# Altium schematic sheet Driver.SchDoc: MotorDriver
size Letter; ApprovedBy: APPROUVÉ PAR; Author: Javier Bolduc; Organization: Cegep Limoilou; Address1: 1300, 8e Avenue; Address2: Québec, QC; Address3: Canada; Address4: G1J 5L5; SheetNumber: 2; SheetTotal: 2
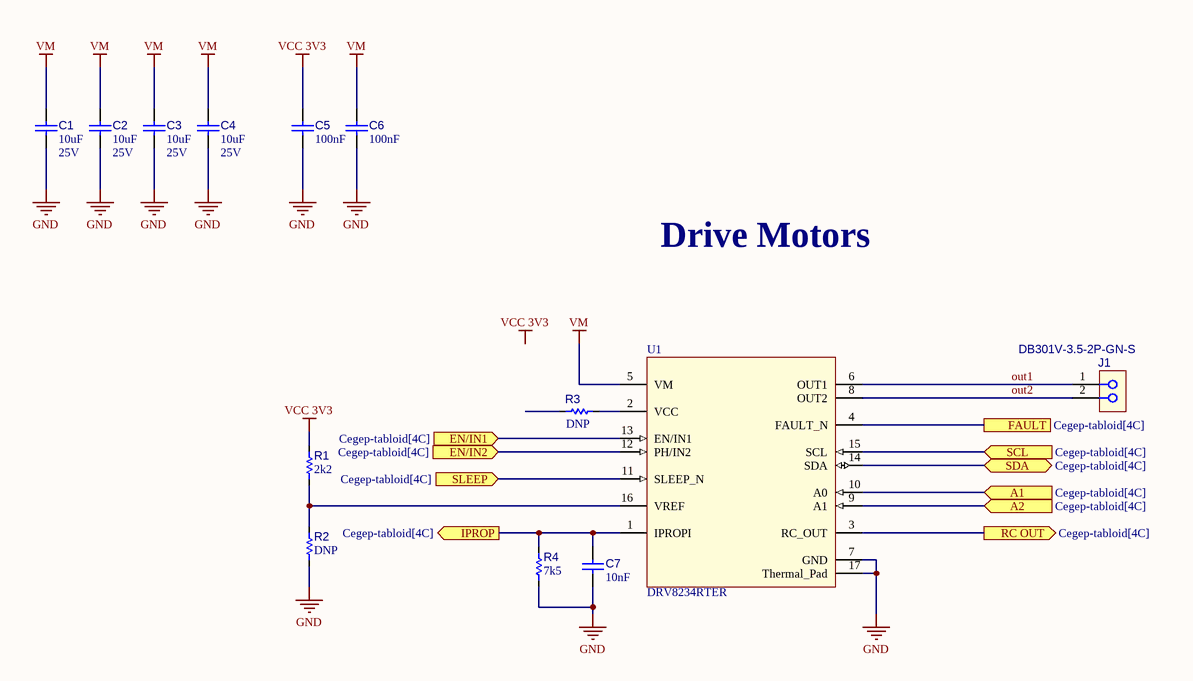
[diagram p0: Driver.SchDoc]

## Parts
C1  value 10uF  Rated Voltage: 25V  [C_2012[0805]]  (hidden comment: CAP CER 10uF 25V X5R 0805)
C2  value 10uF  Rated Voltage: 25V  [C_2012[0805]]  (hidden comment: CAP CER 10uF 25V X5R 0805)
C3  value 10uF  Rated Voltage: 25V  [C_2012[0805]]  (hidden comment: CAP CER 10uF 25V X5R 0805)
C4  value 10uF  Rated Voltage: 25V  [C_2012[0805]]  (hidden comment: CAP CER 10uF 25V X5R 0805)
C5  value 100nF  [C_1005[0402]]  (hidden comment: CAP CER 100nF 50V 0402)
C6  value 100nF  [C_1005[0402]]  (hidden comment: CAP CER 100nF 50V 0402)
C7  value 10nF  [C_1005[0402]]  (hidden comment: CAP CER 10nF 50V X7R 0402)
J1  DB301V-3.5-2P-GN-S  [CONN_TERM_BLOCK_2POS_3mm5]
R1  value 2k2  [R_1005[0402]]  (hidden comment: Res 2k2 1% 0402)
R2  value DNP  [R_1005[0402]]  (hidden comment: Res 2k2 1% 0402)  (no BOM)
R3  value DNP  [R_1005[0402]]  (hidden comment: Res 2k2 1% 0402)  (no BOM)
R4  value 7k5  [R_1005[0402]]  (hidden comment: Res 7k5 1% 0402)
U1  DRV8234RTER  [U_WQFN50P300X300-16]

## Ports
A1 (in, see Cegep-tabloid[4C]), A2 (in, see Cegep-tabloid[4C]), EN/IN1 (in, see Cegep-tabloid[4C]), EN/IN2 (in, see Cegep-tabloid[4C]), FAULT (see Cegep-tabloid[4C]), IPROP (out, see Cegep-tabloid[4C]), RC OUT (out, see Cegep-tabloid[4C]), SCL (in, see Cegep-tabloid[4C]), SDA (bidir, see Cegep-tabloid[4C]), SLEEP (in, see Cegep-tabloid[4C])

## Nets
GND: C1.2 C2.2 C3.2 C4.2 C5.2 C6.2 C7.1 R2.2 R4.2 U1.7(GND) U1.17(Thermal_Pad)
VCC 3V3: C5.1 R1.1
VM: C1.1 C2.1 C3.1 C4.1 C6.1 U1.5(VM)
A1: U1.10(A0) ; port A1
A2: U1.9(A1) ; port A2
EN/IN1: U1.13(EN/IN1) ; port EN/IN1
EN/IN2: U1.12(PH/IN2) ; port EN/IN2
FAULT: U1.4(FAULT_N) ; port FAULT
IPROP: C7.2 R4.1 U1.1(IPROPI) ; port IPROP
out1: J1.1 U1.6(OUT1)
out2: J1.2 U1.8(OUT2)
RC OUT: U1.3(RC_OUT) ; port RC OUT
SCL: U1.15(SCL) ; port SCL
SDA: U1.14(SDA) ; port SDA
SLEEP: U1.11(SLEEP_N) ; port SLEEP
NetR1_2: R1.2 R2.1 U1.16(VREF)
NetR3_1: R3.1 U1.2(VCC)

Not connected (* = marked no-connect by the designer): R3 2

## Notes on the sheet
- Drive Motors
- Labels drawn without touching a wire or pin: VCC 3V3
- Titre :
- Conception :
- Date :
- Approbation :
- Heure :
- Révision :
- Feuille
- de
- Fichier :

## Library data of the parts
C1-C4 = CAP020: Capacitor type 1; Manufacturer 1: Samsung; Manufacturer Part Number 1: CL21A106KAYNNNE; Tolerance: 10%; LibRef: CAP020; Dielectric: X5R; Mounting Technology: SMT; Supplier 1: LCSC; Supplier Part Number 1: C86038
C5 C6 = CAP001: Capacitor type 1; Manufacturer 1: Taiyo Yuden; Manufacturer Part Number 1: UMK105B7104KV-FR; Tolerance: 10%; Dielectric: X7R; Code CEGEP: KCOND01SM; LibRef: CAP001; Rated Voltage: 50V; Mounting Technology: SMT; Supplier 1: LCSC; Supplier Part Number 1: C2167491
C7 = CAP017: Capacitor type 1; Manufacturer 1: Yageo; Manufacturer Part Number 1: CC0402KRX7R9BB103; Tolerance: 10%; LibRef: CAP017; Rated Voltage: 50V; Dielectric: X7R; Mounting Technology: SMT; Supplier 1: LCSC; Supplier Part Number 1: C60133
J1 = CONN-3MM5-2POS-TERM-BLOCK: CONN TERM BLOCK 2POS 3.5mm pitch; Manufacturer 1: Dorabo; Supplier 1: LCSC; Supplier Part Number 1: C695629; Manufacturer Part Number 1: DB301V-3.5-2P-GN-S; Mounting Technology: TH
R1-R3 = RES008: Resistor type 1; Manufacturer 1: Yageo; Manufacturer Part Number 1: RC0402FR-072K2L; Puissance: 1/16W; Max Working Voltage: 50V; Code CEGEP: RES2.2KSM; LibRef: RES008; Tolerance: 1%; Mounting Technology: SMT; Supplier 1: LCSC; Supplier Part Number 1: C114762; Supplier 2: Digi-Key; Supplier Part Number 2: 311-2.20KLRCT-ND
R4 = RES027: Resistor type 1; Manufacturer 1: Yageo; Manufacturer Part Number 1: RC0402FR-077k5L; LibRef: RES027; Puissance: 1/16W; Max Working Voltage: 50V; Tolerance: 1%; Mounting Technology: SMT; Supplier 1: LCSC; Supplier Part Number 1: C137934
U1 = U_DRV8234: Brushed DC H-bridge Motor Driver with Ripple Counting, Stall Detection, and Speed Regulation 38V 2A 16-WQFN; Manufacturer 1: Texas Instruments; Mounting Technology: SMT; Manufacturer Part Number 1: DRV8234RTER; Supplier 1: LCSC